# EAGLE schematic stopwatch (EAGLE 9.2.0)
ABTEILUNG: Technische Informatik; BEARBEITER: Andrej Tica; DATUM: 05.1.2019; DOKUMENTART: Schaltplan; GEZ: TicA; ID: 3AHEL; SCHALTPLAN: Stopwatch; SCHALTPLAN2: Final; STATUS: Final; VER: 1
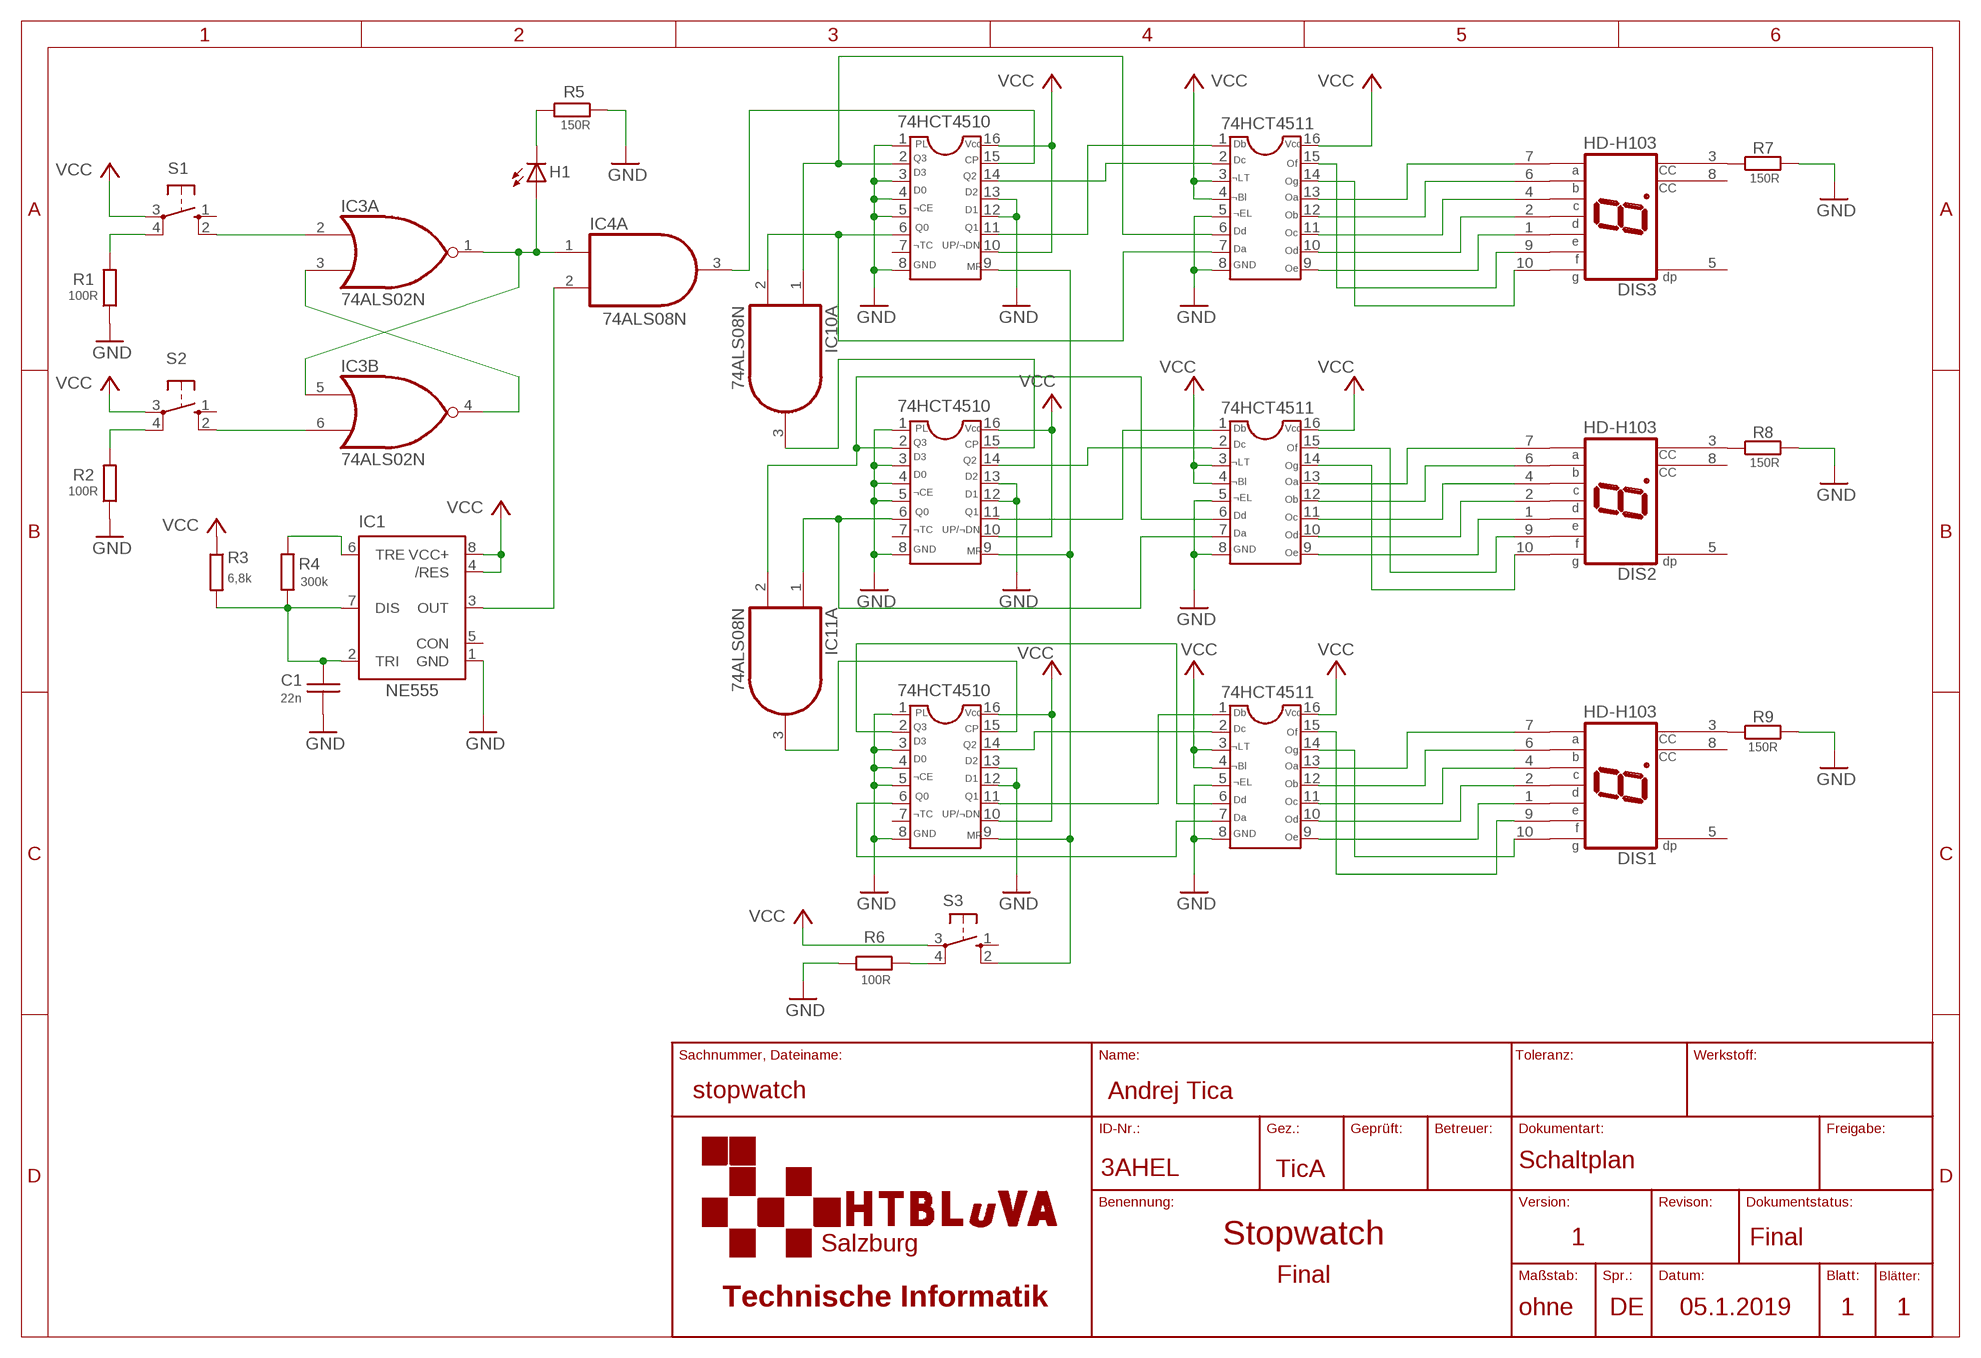
[diagram p0: schematic, sheet 1]

## Parts
C1  22n  C-V_025-025X050  [C025-025X050]
DIS1  HD-H103  [HDSP-M]
DIS2  HD-H103  [HDSP-M]
DIS3  HD-H103  [HDSP-M]
H1  LED_10MM  [LED10MM]
IC1  NE555  [DIL-08]
IC2  74HCT4510  [DIL16]
IC3  74ALS02N  [DIL14]
IC4  74ALS08N  [DIL14]
IC5  74HCT4510  [DIL16]
IC6  74HCT4510  [DIL16]
IC7  74HCT4510  [DIL16]
IC8  74HCT4510  [DIL16]
IC9  74HCT4510  [DIL16]
IC10  74ALS08N  [DIL14]
IC11  74ALS08N  [DIL14]
R1  100R  R-H_0204/7  [0204/7]
R2  100R  R-H_0204/7  [0204/7]
R3  6,8k  R-H_0204/7  [0204/7]
R4  300k  R-H_0204/7  [0204/7]
R5  150R  R-H_0204/7  [0204/7]
R6  100R  R-H_0204/7  [0204/7]
R7  150R  R-H_0204/7  [0204/7]
R8  150R  R-H_0204/7  [0204/7]
R9  150R  R-H_0204/7  [0204/7]
S1  TASTE10-XX  [VERSTäRKER_B3F-10XX]
S2  TASTE10-XX  [VERSTäRKER_B3F-10XX]
S3  TASTE10-XX  [VERSTäRKER_B3F-10XX]

## Nets
GND: C1.2 IC1.1(GND) IC2.1 IC2.3 IC2.4 IC2.5 IC2.8 IC2.12 IC2.13 IC5.5 IC5.8 IC6.1 IC6.3 IC6.4 IC6.5 IC6.8 IC6.12 IC6.13 IC7.1 IC7.3 IC7.4 IC7.5 IC7.8 IC7.12 IC7.13 IC8.5 IC8.8 IC9.5 IC9.8 R1.1 R2.1 R5.1 R6.1 R7.2 R8.2 R9.2
N$1: IC1.6(TRE) R4.2
N$2: R1.2 S3.4(P1)
N$3: IC3.2(A:I0) S3.2(S1)
N$4: R2.2 S2.4(P1)
N$5: IC3.6(B:I1) S2.2(S1)
N$6: H1.A IC3.1(A:O) IC3.5(B:I0) IC4.1(A:I0)
N$7: IC3.3(A:I1) IC3.4(B:O)
N$8: IC1.3(OUT) IC4.2(A:I1)
N$9: C1.1 IC1.2(TRI) IC1.7(DIS) R3.2 R4.1
N$10: H1.K(C) R5.2
N$11: IC2.15 IC4.3(A:O)
N$12: IC2.11 IC5.1
N$13: IC2.14 IC5.2
N$14: IC2.2 IC5.6 IC10.1(A:I0)
N$15: IC2.6 IC5.7 IC10.2(A:I1)
N$16: DIS3.7(A) IC5.13
N$17: DIS3.3(CC) R7.1
N$18: DIS3.6(B) IC5.12
N$19: DIS3.4(C) IC5.11
N$20: DIS3.2(D) IC5.10
N$21: DIS3.1(E) IC5.9
N$22: DIS3.9(F) IC5.15
N$23: DIS3.10(G) IC5.14
N$24: IC2.9 IC6.9 IC7.9 S1.2(S1)
N$25: IC6.15 IC10.3(A:O)
N$26: R6.2 S1.4(P1)
N$27: DIS2.1(E) IC8.9
N$28: IC6.2 IC8.6 IC11.2(A:I1)
N$29: IC6.6 IC8.7 IC11.1(A:I0)
N$30: IC6.11 IC8.1
N$31: IC6.14 IC8.2
N$32: DIS2.2(D) IC8.10
N$33: DIS2.4(C) IC8.11
N$34: DIS2.6(B) IC8.12
N$35: DIS2.7(A) IC8.13
N$36: DIS2.9(F) IC8.15
N$37: DIS2.10(G) IC8.14
N$38: IC7.15 IC11.3(A:O)
N$39: IC7.11 IC9.1
N$40: IC7.14 IC9.2
N$41: DIS1.1(E) IC9.9
N$42: IC7.2 IC9.6
N$43: IC7.6 IC9.7
N$44: DIS1.2(D) IC9.10
N$45: DIS1.4(C) IC9.11
N$46: DIS1.6(B) IC9.12
N$47: DIS1.7(A) IC9.13
N$48: DIS1.10(G) IC9.14
N$49: DIS1.9(F) IC9.15
N$50: DIS2.3(CC) R8.1
N$51: DIS1.3(CC) R9.1
VCC: IC1.4(/RES) IC1.8(VCC+) IC2.10 IC2.16 IC5.3 IC5.4 IC5.16 IC6.10 IC6.16 IC7.10 IC7.16 IC8.3 IC8.4 IC8.16 IC9.3 IC9.4 IC9.16 R3.1 S1.3(P) S2.3(P) S3.3(P)
Unconnected: DIS1.5(DP) DIS1.8(CC) DIS2.5(DP) DIS2.8(CC) DIS3.5(DP) DIS3.8(CC) IC1.5(CON) IC2.7 IC3.8(C:I0) IC3.9(C:I1) IC3.10(C:O) IC3.11(D:I0) IC3.12(D:I1) IC3.13(D:O) IC4.4(B:I0) IC4.5(B:I1) IC4.6(B:O) IC4.8(C:O) IC4.9(C:I0) IC4.10(C:I1) IC4.11(D:O) IC4.12(D:I0) IC4.13(D:I1) IC6.7 IC7.7 IC10.4(B:I0) IC10.5(B:I1) IC10.6(B:O) IC10.8(C:O) IC10.9(C:I0) IC10.10(C:I1) IC10.11(D:O) IC10.12(D:I0) IC10.13(D:I1) IC11.4(B:I0) IC11.5(B:I1) IC11.6(B:O) IC11.8(C:O) IC11.9(C:I0) IC11.10(C:I1) IC11.11(D:O) IC11.12(D:I0) IC11.13(D:I1) S1.1(S) S2.1(S) S3.1(S)

## Power pins joined to a net without a drawn wire
GND: IC3.7(P:GND) IC4.7(P:GND) IC10.7(P:GND) IC11.7(P:GND)
VCC: IC3.14(P:VCC) IC4.14(P:VCC) IC10.14(P:VCC) IC11.14(P:VCC)

## Library data of the parts
C1 = rcl_TicA:C-V_: CAPACITOR, European symbol
DIS1-DIS3 = display-hp:HD-H103: LED DISPLAY 1-character 7 segment, decimal point right; OC_FARNELL: unknown; OC_NEWARK: unknown
H1 = led_TicA:LED_: LED OSRAM: - CHIPLED LG R971, LG N971, LY N971, LG Q971, LY Q971, LO R971, LY R971 LH N974, LH R974 LS Q976, LO Q976, LY Q976 LO Q996 - Hyper CHIPLED LW Q18S LB Q993, LB Q99A, LB R99A - SideLED LS A670, LO A670, LY A670, LG A670, LP A670 LB A673, LV A673, LT A673, LW A673 LH A674 LY A675 LS A676, LA A676, LO A676, LY A676, LW A676 LS A679, LY A679, LG A679 - Hyper Micro SIDELED® LS Y876, LA Y876, LO Y876, LY Y876 LT Y87S - SmartLED LW L88C, LW L88S LB L89C, LB L89S, LG L890 LS L89K, LO L89K, LY L89K LS L896, LA L896, LO L896, LY L896 - TOPLED LS T670, LO T670, LY T670, LG T670, LP T670 LSG T670, LSP T670, LSY T670, LOP T670, LYG T670 LG T671, LOG T671, LSG T671 LB T673, LV T673, LT T673, LW T673 LH T674 LS T676, LA T676, LO T676, LY T676, LB T676, LH T676, LSB T676, LW T676 LB T67C, LV T67C, LT T67C, LS T67K, LO T67K, LY T67K, LW E67C LS E67B, LA E67B, LO E67B, LY E67B, LB E67C, LV E67C, LT E67C LW T67C LS T679, LY T679, LG T679 LS T770, LO T770, LY T770, LG T770, LP T770 LB T773, LV T773, LT T773, LW T773 LH T774 LS E675, LA E675, LY E675, LS T675 LS T776, LA T776, LO T776, LY T776, LB T776 LHGB T686 LT T68C, LB T68C - Hyper Mini TOPLED® LB M676 - Mini TOPLED Santana® LG M470 LS M47K, LO M47K, LY M47K Source: http://www.osram.convergy.de LUXEON: - LUMILED® LXK2-PW12-R00, LXK2-PW12-S00, LXK2-PW14-U00, LXK2-PW14-V00 LXK2-PM12-R00, LXK2-PM12-S00, LXK2-PM14-U00 LXK2-PE12-Q00, LXK2-PE12-R00, LXK2-PE12-S00, LXK2-PE14-T00, LXK2-PE14-U00 LXK2-PB12-K00, LXK2-PB12-L00, LXK2-PB12-M00, LXK2-PB14-N00, LXK2-PB14-P00, LXK2-PB14-Q00 LXK2-PR12-L00, LXK2-PR12-M00, LXK2-PR14-Q00, LXK2-PR14-R00 LXK2-PD12-Q00, LXK2-PD12-R00, LXK2-PD12-S00 LXK2-PH12-R00, LXK2-PH12-S00 LXK2-PL12-P00, LXK2-PL12-Q00, LXK2-PL12-R00 Source: www.luxeon.com KINGBRIGHT: KA-3528ASYC Source: www.kingbright.com
IC1 = st-microelectronics:NE555: General purpose bipolar Timer; MF: Arrow Electronics; MPN: NE555N; OC_FARNELL: 1467742; OC_NEWARK: 89K1486
IC2 IC6 IC7 = ic-logik_TicA:74HCT4510: Dual In Line / Socket
IC3 = 74xx-us:74*02: Quad 2-input NOR gate
IC4 = 74xx-us:74*08: Quad 2-input AND gate
IC5 IC8 IC9 = HEF4511BT:74HCT4510: Dual In Line / Socket
IC10 IC11 = 74xx-us:74*08: Quad 2-input AND gate; SPICEPREFIX: J
R1-R9 = rcl_TicA:R-H_: RESISTOR, European symbol
S1-S3 = switch_TicA:TASTE10-XX: OMRON SWITCH